# Altium schematic sheet PowerManagement.SchDoc: Power management.
size 297 x 209 mm; Author: Dmitry Shpakov; Organization: NoName; Revision: Revision; SheetNumber: 3; SheetTotal: 10; PageSize: A4; ProjectName: Project Name
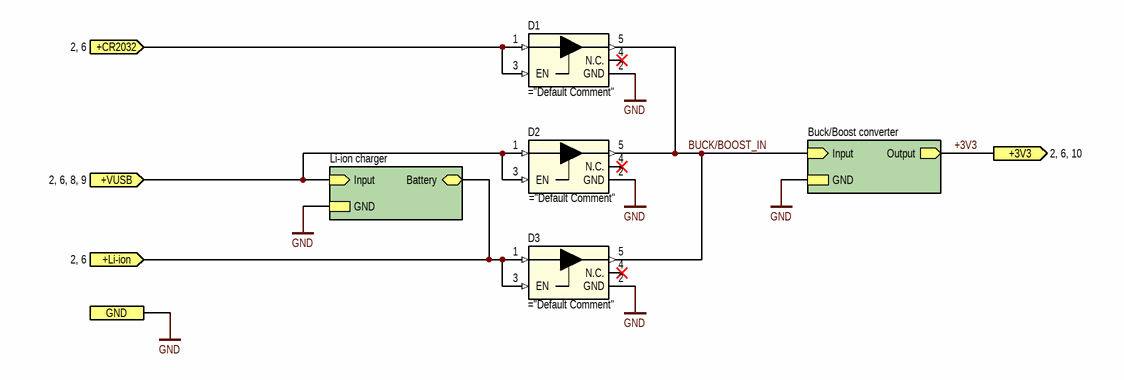
[diagram p0: PowerManagement.SchDoc]

## Parts
D1  (no value)
D2  (no value)
D3  (no value)

## Sub-sheets
Buck/Boost converter = Buck_boost_converter.SchDoc: Input (in), Output (out), GND
Li-ion charger = Li-ion_charger.SchDoc: Input (in), Battery (bidir), GND

## Ports
+3V3 (out, see 2, 6, 10), +CR2032 (in, see 2, 6), +Li-ion (in, see 2, 6), +VUSB (in, see 2, 6, 8, 9), GND (see 2, 4, 5, 6, 7, 8, 9, 10)

## Nets
GND: D1.2(GND) D2.2(GND) D3.2(GND) ; port GND, sheet Buck/Boost converter/GND, sheet Li-ion charger/GND
+3V3: port +3V3, sheet Buck/Boost converter/Output
+CR2032: D1.1(VDD) D1.3(EN) ; port +CR2032
+Li-ion: D3.1(VDD) D3.3(EN) ; port +Li-ion, sheet Li-ion charger/Battery
+VUSB: D2.1(VDD) D2.3(EN) ; port +VUSB, sheet Li-ion charger/Input
BUCK/BOOST_IN: D1.5(OUT) D2.5(OUT) D3.5(OUT) ; sheet Buck/Boost converter/Input

Not connected (* = marked no-connect by the designer): D1 4(N.C.)*; D2 4(N.C.)*; D3 4(N.C.)*

## Notes on the sheet
- Author
- Date
- Organization
- Page
- Total pages
- Materials
- Page size

## Library data of the parts
D1-D3 = MAX40200: IC IDEAL DIODE; Manufacturer: Analog Devices Inc./Maxim Integrated; Default Comment: MAX40203AUK+T; Power Dissipation: * W; Rated Voltage: 1.2 V ~ 5.5 V; Rated Current: 1 A; Tolerance: * %; Other: OR Controller Source Selector Switch P-Channel 1:1 SOT-23-5; Operating Temperature: -40 °C to +125 °C; Type: diode; HelpURL: https://www.digikey.com/en/products/detail/analog-devices-inc-maxim-integrated/MAX40203AUK-T/10447227; Rated Power: * W; Value: *; Summary: ="Type"+" "+"Part Number"+" "+"Manufacturer"+" "+"Value"+" "+"Tolerance"+" "+"Operating Temperature"+" "+"Case"+" "+"Power Dissipation"+" "+"Rated Current"+" "+"Rated Power"+" "+"Rated Voltage"+" "+"Other"; Assembly: *; Case: SOT-23-5; Part Number: MAX40203AUK+T